# Altium schematic sheet PCB_Master_Traffic_Light.SchDoc
size A3; SheetNumber: 3; SheetTotal: 3; SPICEModelCacheWQSXSIZM: <root> / <DocumentId>WQSXSIZM</DocumentId> / </root>
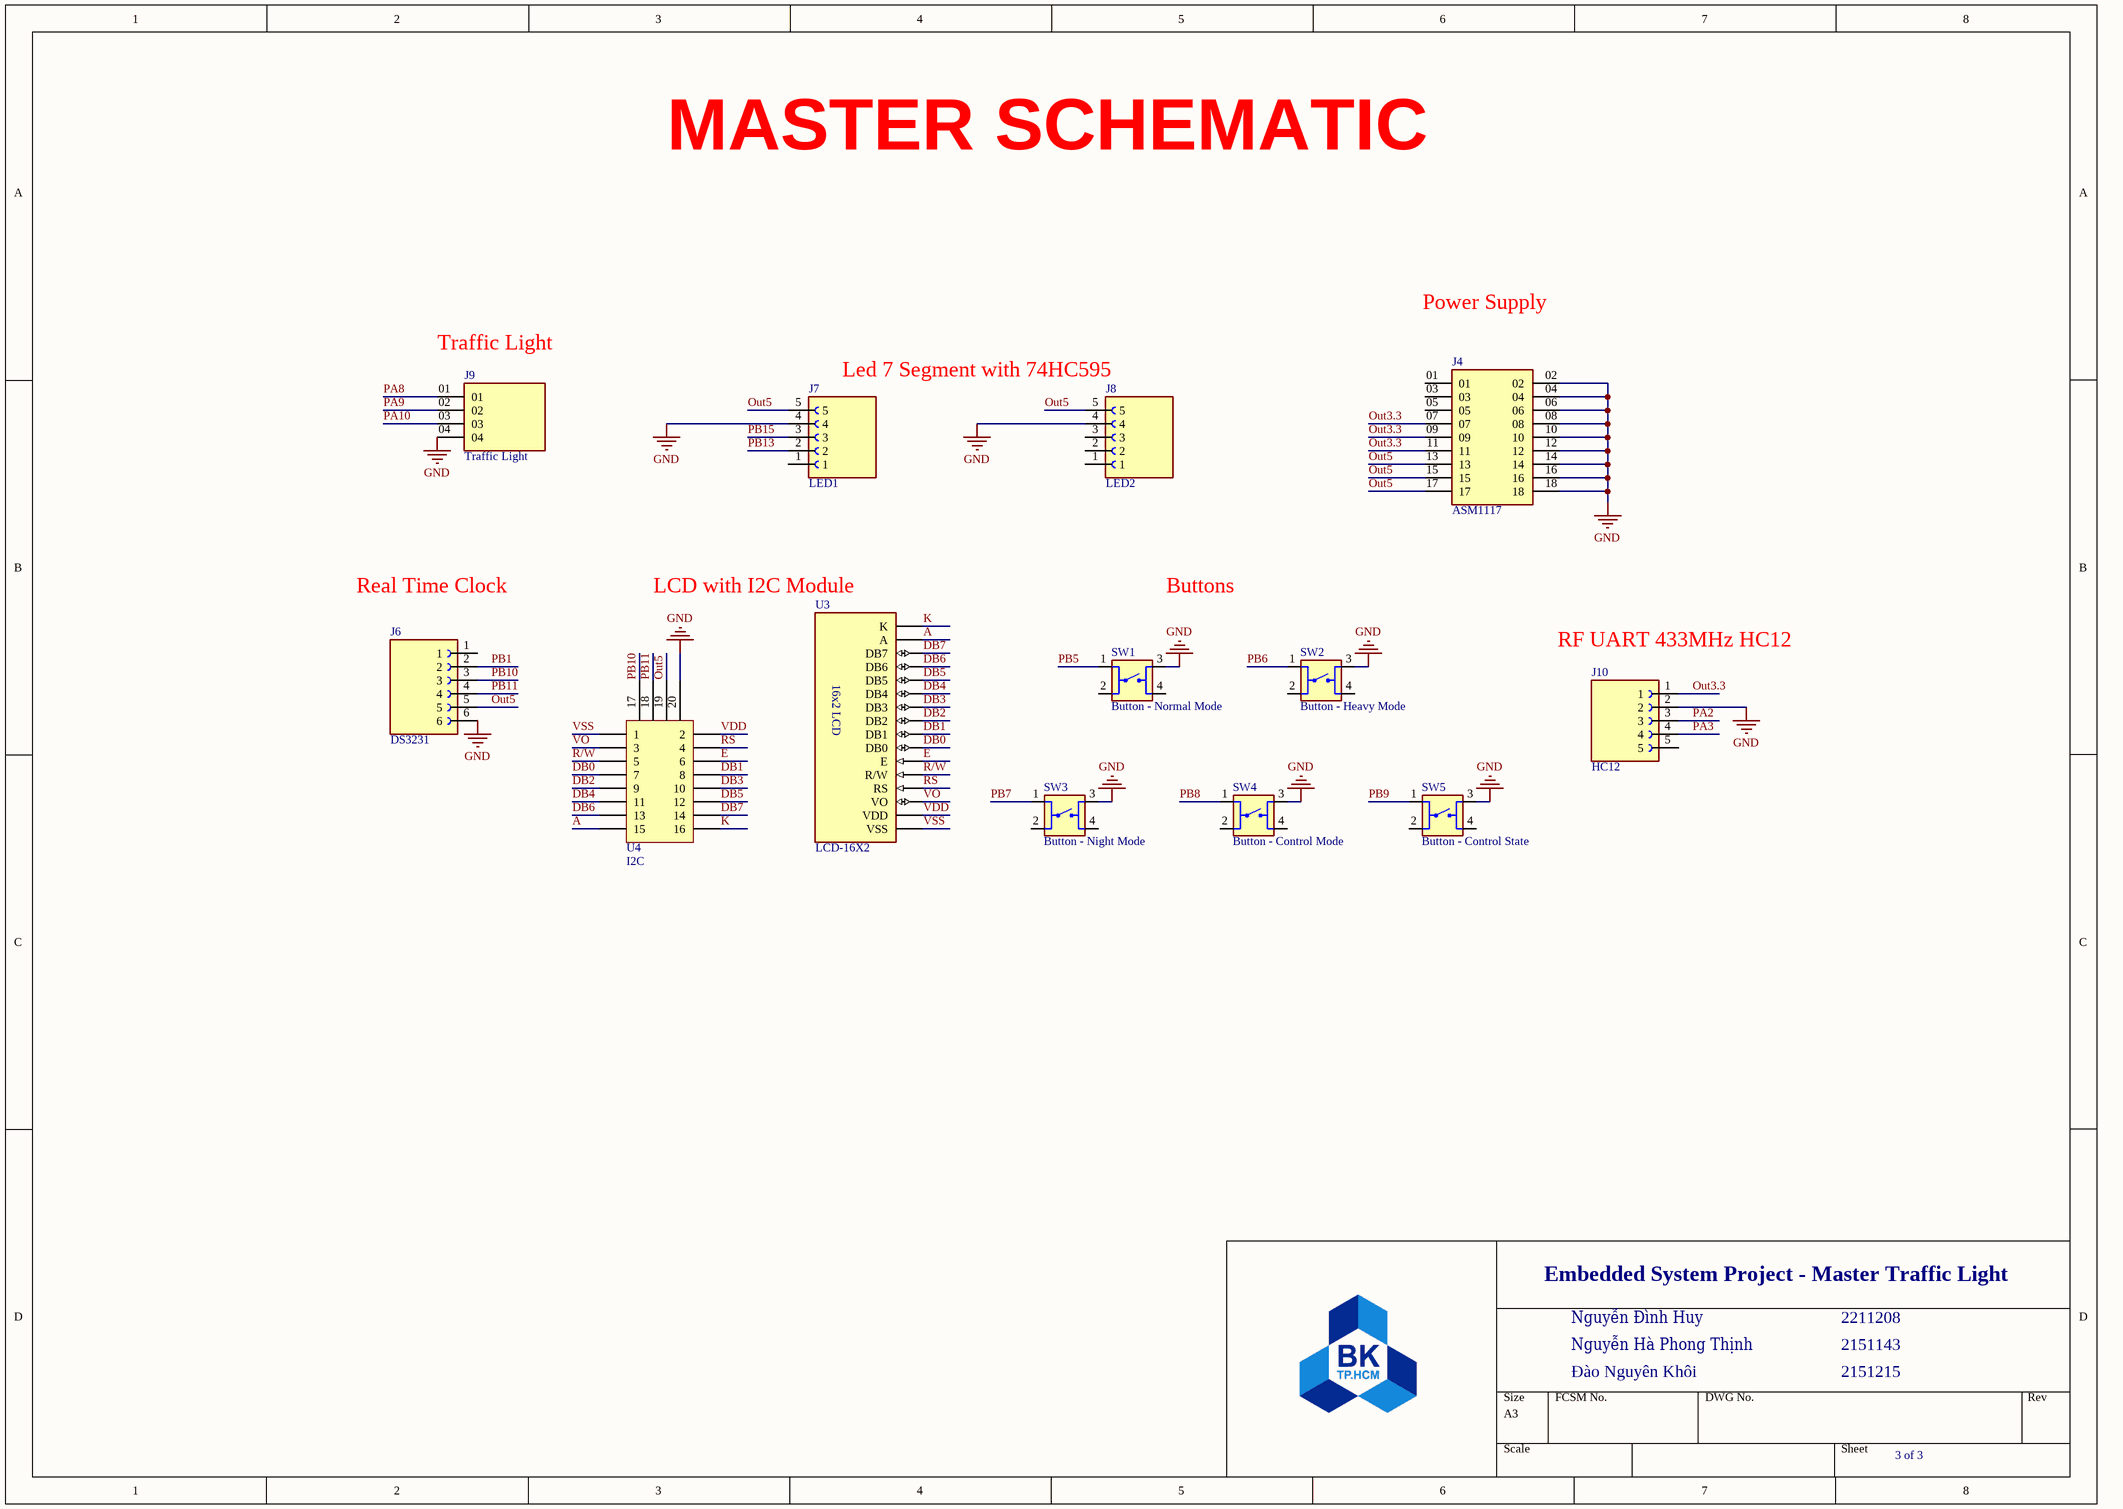
[diagram p0: PCB_Master_Traffic_Light.SchDoc]

## Parts
J4  ASM1117  [SAMTEC_MTSW-109-13-G-D-905]
J6  DS3231  [HARWIN_M20-7820646]
J7  LED1  [HARWIN_M20-7820546]
J8  LED2  [HARWIN_M20-7820546]
J9  Traffic Light  [SAMTEC_HTSW-104-23-SM-S]
J10  HC12  [HARWIN_M20-7820546]
SW1  Button - Normal Mode  [SW_FSM8JH]
SW2  Button - Heavy Mode  [SW_FSM8JH]
SW3  Button - Night Mode  [SW_FSM8JH]
SW4  Button - Control Mode  [SW_FSM8JH]
SW5  Button - Control State  [SW_FSM8JH]
U3  LCD-16X2  [MODULE_LCD-16X2]
U4  I2C  [PCF8574]

## Nets
GND: J4.02 J4.04 J4.06 J4.08 J4.10 J4.12 J4.14 J4.16 J4.18 J6.6 J7.4 J8.4 J9.04 J10.2 SW1.3 SW2.3 SW3.3 SW4.3 SW5.3 U4.20
A: U3.15(A) U4.15
DB0: U3.7(DB0) U4.7
DB1: U3.8(DB1) U4.8
DB2: U3.9(DB2) U4.9
DB3: U3.10(DB3) U4.10
DB4: U3.11(DB4) U4.11
DB5: U3.12(DB5) U4.12
DB6: U3.13(DB6) U4.13
DB7: U3.14(DB7) U4.14
E: U3.6(E) U4.6
K: U3.16(K) U4.16
Out3.3: J4.07 J4.09 J4.11 J10.1
Out5: J4.13 J4.15 J4.17 J6.5 J7.5 J8.5 U4.19
PA2: J10.3
PA3: J10.4
PA8: J9.01
PA9: J9.02
PA10: J9.03
PB1: J6.2
PB5: SW1.1
PB6: SW2.1
PB7: SW3.1
PB8: SW4.1
PB9: SW5.1
PB10: J6.3 U4.17
PB11: J6.4 U4.18
PB13: J7.2
PB15: J7.3
R/W: U3.5(R/W) U4.5
RS: U3.4(RS) U4.4
VDD: U3.2(VDD) U4.2
VO: U3.3(VO) U4.3
VSS: U3.1(VSS) U4.1

Not connected (* = marked no-connect by the designer): J4 01 03 05; J6 1; J7 1; J8 1 2 3; J10 5; SW1 2 4; SW2 2 4; SW3 2 4; SW4 2 4; SW5 2 4

## Notes on the sheet
- MASTER SCHEMATIC
- Power Supply
- (near J9) Traffic Light
- Led 7 Segment with 74HC595
- Real Time Clock
- (near U3) LCD with I2C Module
- Buttons
- (near J10) RF UART 433MHz HC12
- Embedded System Project - Master Traffic Light
- Nguyễn Đình Huy
- 2211208
- Nguyễn Hà Phong Thịnh
- Đào Nguyên Khôi
- 2151143
- 2151215
- 3 of 3
- (in symbol LCD-16X2) 16x2 LCD

## Library data of the parts
J4 = MTSW-109-13-G-D-905: Package: None; Price: None; Value: *; MP: MTSW-109-13-G-D-905; Availability: Unavailable
J6 = M20-7820646: Package: None; Price: None; Value: *; MP: M20-7820646; Availability: Unavailable
J7 J8 J10 = M20-7820546: Package: None; Price: None; Value: *; MP: M20-7820546; Availability: Unavailable
J9 = HTSW-104-23-SM-S: HEADER, 4 CONTACTS, 1 ROW, THROUGH HOLE, 2.54 MM; Connector Systems:Board-to-Board; Pitch Spacing:2.54mm; No. of Rows:1Rows; No. of Contacts:4Contacts; Contact Termination Type:Through Hole; Product Range:HTSW Series; Gender:Header RoHS Compliant: Yes; MF: Samtec; MP: HTSW10423SMS; Package: None; Price: None; Check_prices: https://www.snapeda.com/parts/HTSW10423SMS/Samtec/view-part/?ref=eda; Value: *; SnapEDA_Link: https://www.snapeda.com/parts/HTSW10423SMS/Samtec/view-part/?ref=snap; Availability: In Stock; Purchase-URL: https://pricing.snapeda.com/search/part/HTSW10423SMS/?ref=eda
SW1-SW5 = FSM8JH: Tactile Switch SPST-NO Top Actuated Through Hole; MF: TE Connectivity; Check_prices: https://www.snapeda.com/parts/FSM8JH/TE+Connectivity+ALCOSWITCH+Switches/view-part/?ref=eda; Value: *; Availability: In Stock; MP: FSM8JH; Price: None; Package: None; SnapEDA_Link: https://www.snapeda.com/parts/FSM8JH/TE+Connectivity+ALCOSWITCH+Switches/view-part/?ref=snap
U3 = LCD-16X2: Display Development Tools 16x2 Black on Green Char LCD w Backlight; MF: Gravitech; SnapEDA_Link: https://www.snapeda.com/parts/LCD-16X2/Gravitech/view-part/?ref=snap; Package: None; Value: *; MP: LCD-16X2; Check_prices: https://www.snapeda.com/parts/LCD-16X2/Gravitech/view-part/?ref=eda
U4 = PCF8574